# Altium schematic sheet 计量.SchDoc
size A4
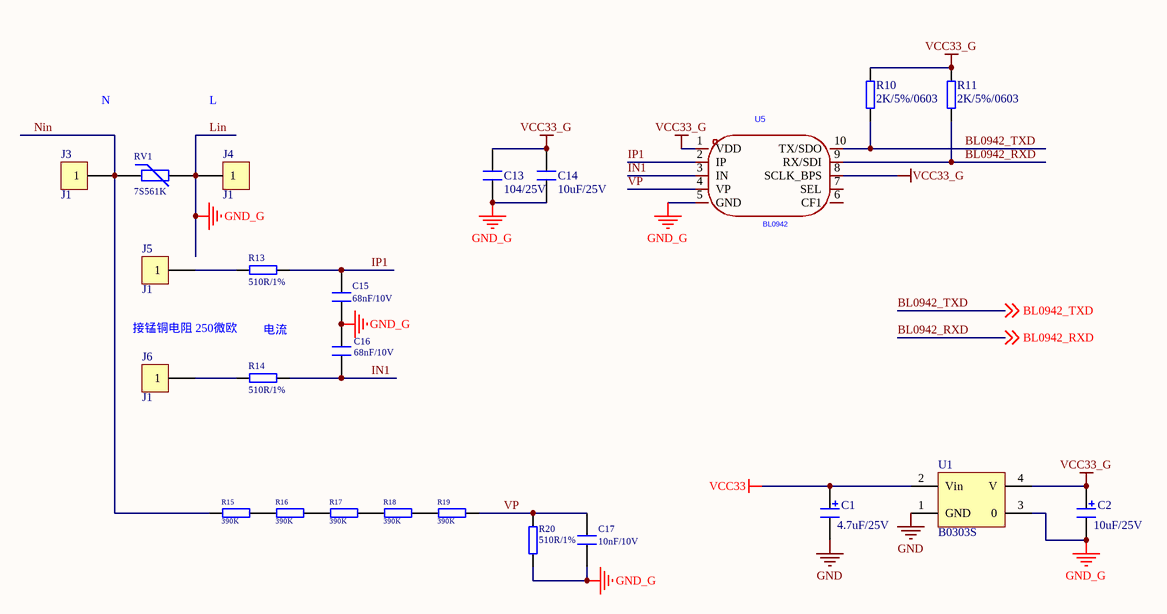
[diagram p0: 计量.SchDoc]

## Parts
C1  4.7uF/25V  [0805R]
C2  10uF/25V  [0805R]
C13  104/25V  [0603R]
C14  10uF/25V  [0603R]
C15  68nF/10V  [0603R]
C16  68nF/10V  [0603R]
C17  10nF/10V  [0603R]
J3  J1  [贴片焊盘V1（3*2椭圆）]
J4  J1  [贴片焊盘V1（3*2椭圆）]
J5  J1  [贴片焊盘V1（3*2椭圆）]
J6  J1  [贴片焊盘V1（3*2椭圆）]
R10  2K/5%/0603  [0603R]
R11  2K/5%/0603  [0603R]
R13  510R/1%  [0603R]
R14  510R/1%  [0603R]
R15  390K  [0805R]
R16  390K  [0805R]
R17  390K  [0805R]
R18  390K  [0805R]
R19  390K  [0805R]
R20  510R/1%  [0603R]
RV1  7S561K  [10D821K]
U1  B0303S  [B1205S-1WR3]
U5  BL0942  [BL0942-10pin]

## Nets
GND: C1.2 U1.1(GND)
Lin: C2.2 C13.1 C14.1 C15.2 C16.2 C17.2 J4.1 R20.1 RV1.2 U1.3(0) U5.5(GND)  [also labelled GND_G]
VCC33: C1.1 U1.2(Vin)
VCC33_G: C2.1 C13.2 C14.2 R10.2 R11.2 U1.4(V) U5.1(VDD) U5.8(SCLK_BPS)
BL0942_RXD: R11.1 U5.9(RX/SDI) ; off-sheet BL0942_RXD
BL0942_TXD: R10.1 U5.10(TX/SDO) ; off-sheet BL0942_TXD
IN1: C16.1 R14.2 U5.3(IN)
IP1: C15.1 R13.2 U5.2(IP)
Nin: J3.1 R15.2 RV1.1
VP: C17.1 R19.1 R20.2 U5.4(VP)
NetJ5_1: J5.1 R13.1
NetJ6_1: J6.1 R14.1
NetR15_1: R15.1 R16.2
NetR16_1: R16.1 R17.2
NetR17_1: R17.1 R18.2
NetR18_1: R18.1 R19.2

Not connected (* = marked no-connect by the designer): U5 6(CF1) 7(SEL)

## Notes on the sheet
- N
- L
- 接锰铜电阻 250微欧
- 电流

## Library data of the parts
C1 C2 = CAP+
C13 C14 = CAP_1
C15-C17 = CAP
R10 R11 R13-R20 = RES
RV1 = Res Varistor: Varistor (Voltage-Sensitive Resistor); Published: 24-Mar-1999; LatestRevisionDate: 29-May-2009; LatestRevisionNote: IPC-7351 Footprint Added.; PackageVersion: Mar-2003; PackageReference: 6-0805; Publisher: Altium Limited; PackageDescription: Chip Resistor 0805 Case Size; Code_IPC: RESC2012
U1 = B0505S
U5 = BL0942_C2837510: Manufacturer: BL(上海贝岭); Add into BOM: yes; Symbol: BL0942; Device: BL0942_C2837510; LCSC Part Name: BL0942内置时钟免校准计量芯片; Supplier Part: C2837510; Manufacturer Part: BL0942; Supplier Footprint: SSOP-10-150mil; JLCPCB Part Class: Extended Part; Datasheet: https://atta.szlcsc.com/upload/public/pdf/source/20220627/BFAD44701CA6DE9A8853C5A4834B6884.pdf; Supplier: LCSC; Convert to PCB: yes